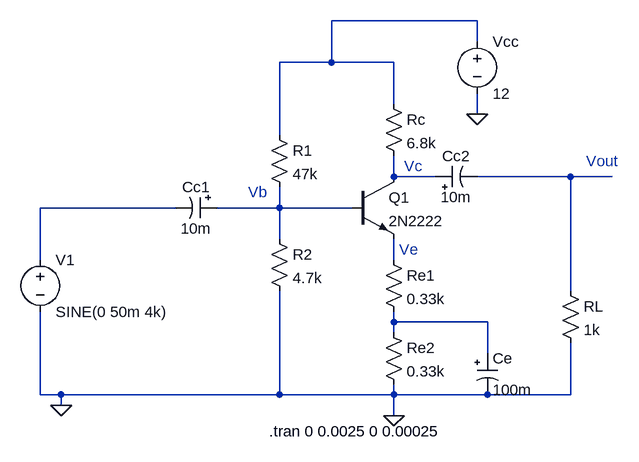
[diagram p0: schematic Draft10.asc]
Draft10.asc, the LTspice schematic file:
Version 4
SHEET 1 880 680
WIRE 416 -112 192 -112
WIRE 416 -80 416 -112
WIRE 192 -48 192 -112
WIRE 192 -48 112 -48
WIRE 288 -48 192 -48
WIRE 288 16 288 -48
WIRE 416 32 416 0
WIRE 112 64 112 -48
WIRE 288 128 288 96
WIRE 352 128 288 128
WIRE 560 128 416 128
WIRE 624 128 560 128
WIRE -48 176 -256 176
WIRE 112 176 112 144
WIRE 112 176 16 176
WIRE 224 176 112 176
WIRE 112 224 112 176
WIRE -256 256 -256 176
WIRE 288 256 288 224
WIRE 560 304 560 128
WIRE 288 352 288 336
WIRE 432 352 288 352
WIRE 288 368 288 352
WIRE 432 400 432 352
WIRE -256 464 -256 336
WIRE -224 464 -256 464
WIRE 112 464 112 304
WIRE 112 464 -224 464
WIRE 288 464 288 448
WIRE 288 464 112 464
WIRE 432 464 288 464
WIRE 560 464 560 384
WIRE 560 464 432 464
WIRE -224 480 -224 464
WIRE 288 496 288 464
FLAG 288 496 0
FLAG 416 32 0
FLAG -224 480 0
SYMBOL res 96 48 R0
SYMATTR InstName R1
SYMATTR Value 47k
SYMBOL res 96 208 R0
SYMATTR InstName R2
SYMATTR Value 4.7k
SYMBOL npn 224 128 R0
SYMATTR InstName Q1
SYMATTR Value 2N2222
SYMBOL res 272 240 R0
SYMATTR InstName Re1
SYMATTR Value 0.33k
SYMBOL res 272 352 R0
SYMATTR InstName Re2
SYMATTR Value 0.33k
SYMBOL res 272 0 R0
SYMATTR InstName Rc
SYMATTR Value 6.8k
SYMBOL voltage -256 240 R0
WINDOW 123 0 0 Left 0
WINDOW 39 0 0 Left 0
SYMATTR InstName V1
SYMATTR Value SINE(0 50m 4k)
SYMBOL polcap 16 160 R90
WINDOW 0 0 32 VBottom 2
WINDOW 3 32 32 VTop 2
SYMATTR InstName Cc1
SYMATTR Value 10m
SYMBOL polcap 416 400 R0
SYMATTR InstName Ce
SYMATTR Value 100m
SYMBOL voltage 416 -96 R0
WINDOW 123 0 0 Left 0
WINDOW 39 0 0 Left 0
SYMATTR InstName Vcc
SYMATTR Value 12
SYMBOL polcap 352 144 R270
WINDOW 0 32 32 VTop 2
WINDOW 3 0 32 VBottom 2
SYMATTR InstName Cc2
SYMATTR Value 10m
SYMBOL res 544 288 R0
SYMATTR InstName RL
SYMATTR Value 1k
TEXT 96 520 Left 2 !.tran 0 0.0025 0 0.00025
TEXT 64 152 Left 2 ;Vb
TEXT 304 112 Left 2 ;Vc
TEXT 296 240 Left 2 ;Ve
TEXT 584 104 Left 2 ;Vout

The netlist it stands for:
* Draft10.asc
R1 N001 N005 47k
R2 N005 0 4.7k
Q1 N002 N005 N006 0 2N2222
Re1 N006 N007 0.33k
Re2 N007 0 0.33k
Rc N001 N002 6.8k
V1 N004 0 SINE(0 50m 4k)
Cc1 N005 N004 10m
Ce N007 0 100m
Vcc N001 0 12
Cc2 N002 N003 10m
RL N003 0 1k
.model NPN NPN
.model PNP PNP
.lib standard.bjt
.tran 0 0.0025 0 0.00025
* Vb
* Vc
* Ve
* Vout
.backanno
.end